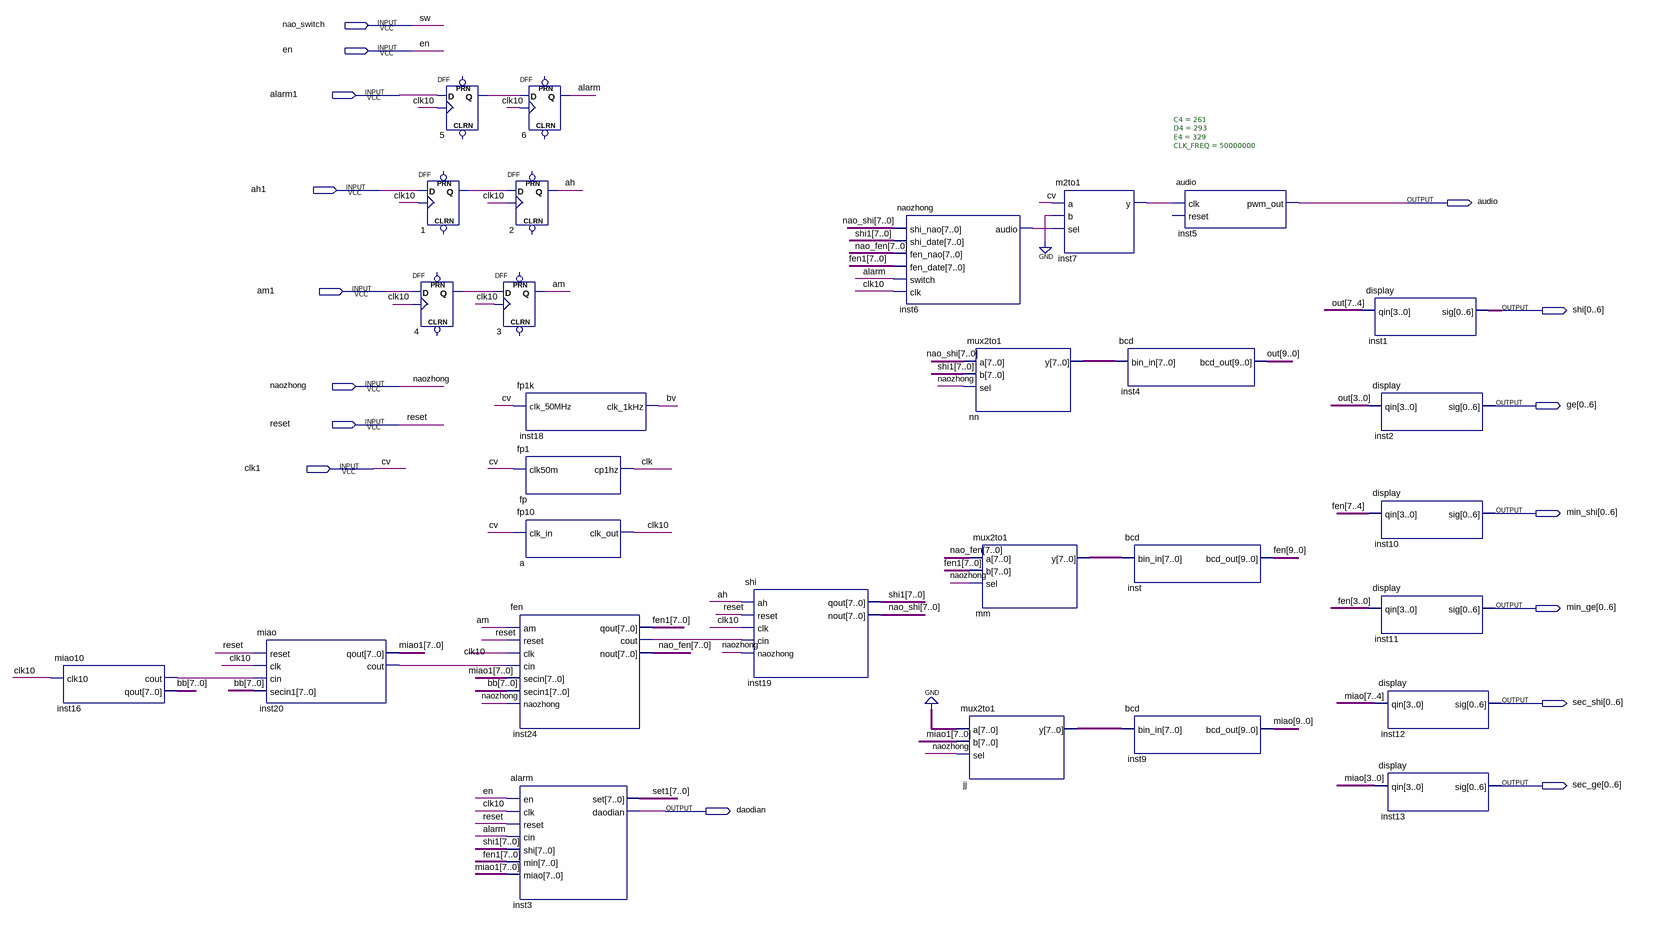
[diagram p0: schematic sheet]
// Quartus schematic shuzizhong.bdf as structural Verilog: 29 symbols, 16 pins
module shuzizhong (
  input  nao_switch,
  input  en,
  input  alarm1,
  input  ah1,
  input  am1,
  input  naozhong,
  input  reset,
  input  clk1,
  output audio,
  output [0:6] shi,
  output [0:6] ge,
  output [0:6] min_shi,
  output [0:6] min_ge,
  output [0:6] sec_shi,
  output [0:6] sec_ge,
  output daodian
);

  wire ah, alarm, am, bv, clk, clk10, inst6_audio, inst7_y, inst16_cout, inst20_cout, inst24_cout, n1_q,
       n4_q, n5_q;
  wire [7:0] bb, fen1, jj_y, miao1, mm_y, nao_fen, nao_shi, nn_y, set1, shi1;
  wire [9:0] fen, miao, out;

  miao10 inst16 (.clk10(clk10), .cout(inst16_cout), .qout(bb));
  miao inst20 (.reset(reset), .clk(clk10), .cin(inst16_cout), .secin1(bb), .qout(miao1), .cout(inst20_cout));
  DFF u_5 (.CLK(clk10), .D(alarm1), .Q(n5_q));  // open: CLRN, PRN
  DFF u_1 (.CLK(clk10), .D(ah1), .Q(n1_q));  // open: CLRN, PRN
  DFF u_4 (.CLK(clk10), .D(am1), .Q(n4_q));  // open: CLRN, PRN
  DFF u_6 (.CLK(clk10), .D(n5_q), .Q(alarm));  // open: CLRN, PRN
  DFF u_2 (.CLK(clk10), .D(n1_q), .Q(ah));  // open: CLRN, PRN
  DFF u_3 (.CLK(clk10), .D(n4_q), .Q(am));  // open: CLRN, PRN
  fp1k inst18 (.clk_50MHz(clk1), .clk_1kHz(bv));
  fp1 fp (.clk50m(clk1), .cp1hz(clk));
  fp10 a (.clk_in(clk1), .clk_out(clk10));
  fen inst24 (
    .am(am), .reset(reset), .clk(clk10), .cin(inst20_cout), .secin(miao1), .secin1(bb), .naozhong(naozhong),
    .qout(fen1), .cout(inst24_cout), .nout(nao_fen));
  alarm inst3 (
    .en(en), .clk(clk10), .reset(reset), .cin(alarm), .shi(shi1), .min(fen1), .miao(miao1), .set(set1),
    .daodian(daodian));
  shi inst19 (.ah(ah), .reset(reset), .clk(clk10), .cin(inst24_cout), .naozhong(naozhong), .qout(shi1), .nout(nao_shi));
  naozhong inst6 (
    .shi_nao(nao_shi), .shi_date(shi1), .fen_nao(nao_fen), .fen_date(fen1), .switch(alarm), .clk(clk10),
    .audio(inst6_audio));
  mux2to1 nn (.a(nao_shi), .b(shi1), .sel(naozhong), .y(nn_y));
  mux2to1 mm (.a(nao_fen), .b(fen1), .sel(naozhong), .y(mm_y));
  mux2to1 jj (.a({8{1'b0}}), .b(miao1), .sel(naozhong), .y(jj_y));
  m2to1 inst7 (.a(clk1), .b(1'b0), .sel(inst6_audio), .y(inst7_y));
  bcd inst4 (.bin_in(nn_y), .bcd_out(out));
  bcd inst (.bin_in(mm_y), .bcd_out(fen));
  bcd inst9 (.bin_in(jj_y), .bcd_out(miao));
  audio #(.C4(261), .D4(293), .E4(329), .CLK_FREQ(50000000)) inst5 (.clk(inst7_y), .pwm_out(audio));  // open: reset
  display inst1 (.qin(out[7:4]), .sig(shi));
  display inst2 (.qin(out[3:0]), .sig(ge));
  display inst10 (.qin(fen[7:4]), .sig(min_shi));
  display inst11 (.qin(fen[3:0]), .sig(min_ge));
  display inst12 (.qin(miao[7:4]), .sig(sec_shi));
  display inst13 (.qin(miao[3:0]), .sig(sec_ge));

  // Other names for the same wires on the sheet: cv = clk1; sw = nao_switch
endmodule
